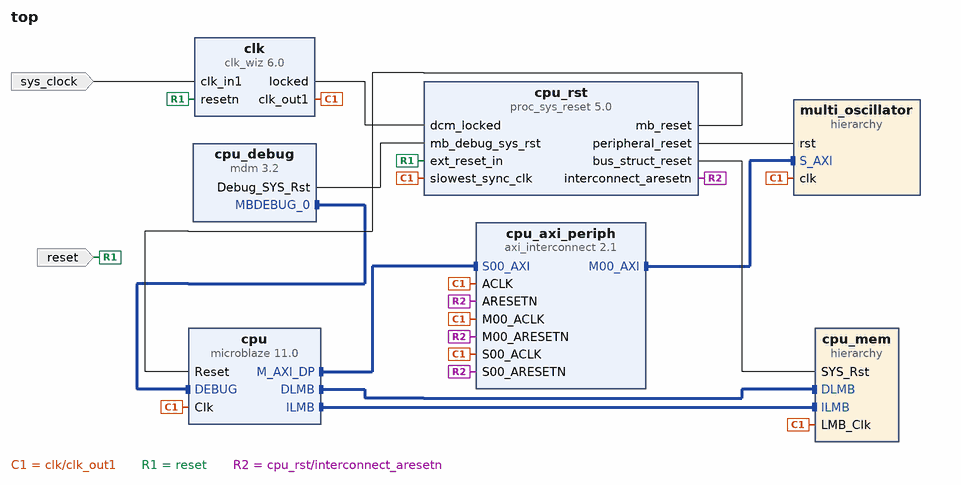
[diagram p0: block diagram of the top level]
# Vivado block design top, xc7a35ticsg324-1L, Vivado 2020.1
create_bd_design top

create_bd_port -dir I -type clk sys_clock
set_property -dict {CONFIG.FREQ_HZ 100000000 CONFIG.PHASE 0.000} [get_bd_ports sys_clock]
create_bd_port -dir I -type rst reset
set_property -dict {CONFIG.POLARITY ACTIVE_LOW} [get_bd_ports reset]

create_bd_cell -type ip -vlnv xilinx.com:ip:clk_wiz:6.0 clk
set_property -dict [list \
  CONFIG.CLK_IN1_BOARD_INTERFACE sys_clock \
  CONFIG.RESET_BOARD_INTERFACE reset \
  CONFIG.RESET_PORT resetn \
  CONFIG.RESET_TYPE ACTIVE_LOW \
  CONFIG.USE_BOARD_FLOW true \
] [get_bd_cells clk]
create_bd_cell -type ip -vlnv xilinx.com:ip:microblaze:11.0 cpu
set_property -dict [list \
  CONFIG.C_ADDR_TAG_BITS 0 \
  CONFIG.C_BRANCH_TARGET_CACHE_SIZE 0 \
  CONFIG.C_DCACHE_ADDR_TAG 0 \
  CONFIG.C_DEBUG_ENABLED 1 \
  CONFIG.C_DIV_ZERO_EXCEPTION 1 \
  CONFIG.C_D_AXI 1 \
  CONFIG.C_D_LMB 1 \
  CONFIG.C_ENABLE_DISCRETE_PORTS 0 \
  CONFIG.C_I_LMB 1 \
  CONFIG.C_M_AXI_D_BUS_EXCEPTION 0 \
  CONFIG.C_NUMBER_OF_PC_BRK 4 \
  CONFIG.C_NUMBER_OF_RD_ADDR_BRK 2 \
  CONFIG.C_NUMBER_OF_WR_ADDR_BRK 2 \
  CONFIG.C_UNALIGNED_EXCEPTIONS 0 \
  CONFIG.C_USE_BARREL 1 \
  CONFIG.C_USE_BRANCH_TARGET_CACHE 1 \
  CONFIG.C_USE_DCACHE 0 \
  CONFIG.C_USE_DIV 1 \
  CONFIG.C_USE_FPU 0 \
  CONFIG.C_USE_HW_MUL 2 \
  CONFIG.C_USE_ICACHE 0 \
  CONFIG.C_USE_MSR_INSTR 0 \
  CONFIG.G_USE_EXCEPTIONS 1 \
] [get_bd_cells cpu]
create_bd_cell -type hier cpu_mem
create_bd_cell -type ip -vlnv xilinx.com:ip:mdm:3.2 cpu_debug
create_bd_cell -type ip -vlnv xilinx.com:ip:proc_sys_reset:5.0 cpu_rst
set_property -dict {CONFIG.RESET_BOARD_INTERFACE reset CONFIG.USE_BOARD_FLOW true} [get_bd_cells cpu_rst]
create_bd_cell -type ip -vlnv xilinx.com:ip:axi_interconnect:2.1 cpu_axi_periph
set_property -dict [list \
  CONFIG.ENABLE_ADVANCED_OPTIONS 0 \
  CONFIG.M00_HAS_REGSLICE 0 \
  CONFIG.NUM_MI 1 \
  CONFIG.NUM_SI 1 \
] [get_bd_cells cpu_axi_periph]
create_bd_cell -type hier multi_oscillator

# ---- hierarchy /cpu_mem ----
current_bd_instance /cpu_mem
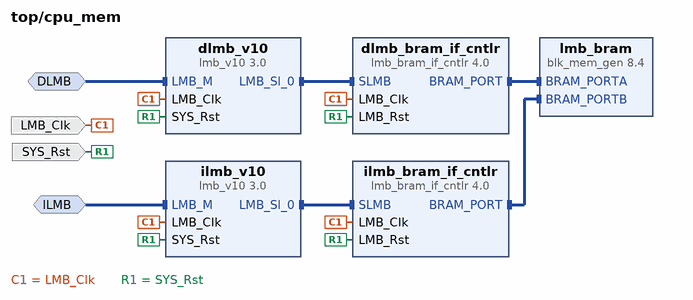
[diagram p1: block diagram inside /cpu_mem]
create_bd_intf_pin -mode MirroredMaster -vlnv xilinx.com:interface:lmb_rtl:1.0 DLMB
create_bd_intf_pin -mode MirroredMaster -vlnv xilinx.com:interface:lmb_rtl:1.0 ILMB
create_bd_pin -dir I -type clk LMB_Clk
create_bd_pin -dir I -type rst SYS_Rst

create_bd_cell -type ip -vlnv xilinx.com:ip:lmb_v10:3.0 dlmb_v10
create_bd_cell -type ip -vlnv xilinx.com:ip:lmb_v10:3.0 ilmb_v10
create_bd_cell -type ip -vlnv xilinx.com:ip:lmb_bram_if_cntlr:4.0 dlmb_bram_if_cntlr
set_property -dict {CONFIG.C_ECC 0} [get_bd_cells dlmb_bram_if_cntlr]
create_bd_cell -type ip -vlnv xilinx.com:ip:lmb_bram_if_cntlr:4.0 ilmb_bram_if_cntlr
set_property -dict {CONFIG.C_ECC 0} [get_bd_cells ilmb_bram_if_cntlr]
create_bd_cell -type ip -vlnv xilinx.com:ip:blk_mem_gen:8.4 lmb_bram
set_property -dict {CONFIG.Memory_Type True_Dual_Port_RAM CONFIG.use_bram_block BRAM_Controller} [get_bd_cells lmb_bram]

# ---- hierarchy /multi_oscillator ----
current_bd_instance /multi_oscillator
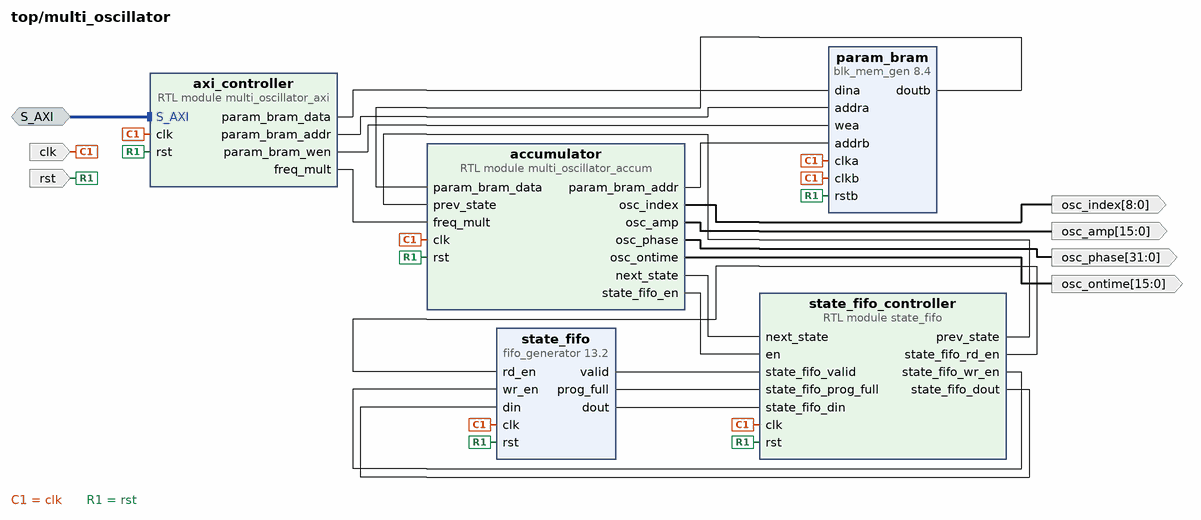
[diagram p2: block diagram inside /multi_oscillator]
create_bd_intf_pin -mode Slave -vlnv xilinx.com:interface:aximm_rtl:1.0 S_AXI
create_bd_pin -dir I -type clk clk
create_bd_pin -dir I -type rst rst
create_bd_pin -dir O -from 8 -to 0 osc_index
create_bd_pin -dir O -from 31 -to 0 osc_phase
create_bd_pin -dir O -from 15 -to 0 osc_amp
create_bd_pin -dir O -from 15 -to 0 osc_ontime

create_bd_cell -type ip -vlnv xilinx.com:ip:blk_mem_gen:8.4 param_bram
set_property -dict [list \
  CONFIG.Assume_Synchronous_Clk true \
  CONFIG.EN_SAFETY_CKT false \
  CONFIG.Enable_32bit_Address false \
  CONFIG.Enable_A Always_Enabled \
  CONFIG.Enable_B Always_Enabled \
  CONFIG.Memory_Type Simple_Dual_Port_RAM \
  CONFIG.Operating_Mode_A WRITE_FIRST \
  CONFIG.Port_B_Clock 100 \
  CONFIG.Port_B_Enable_Rate 100 \
  CONFIG.Read_Width_B 64 \
  CONFIG.Register_PortB_Output_of_Memory_Primitives true \
  CONFIG.Use_Byte_Write_Enable false \
  CONFIG.Use_RSTB_Pin true \
  CONFIG.Write_Depth_A 1024 \
  CONFIG.Write_Width_B 64 \
  CONFIG.use_bram_block Stand_Alone \
] [get_bd_cells param_bram]
create_bd_cell -type module -reference state_fifo state_fifo_controller
create_bd_cell -type ip -vlnv xilinx.com:ip:fifo_generator:13.2 state_fifo
set_property -dict [list \
  CONFIG.Fifo_Implementation Common_Clock_Builtin_FIFO \
  CONFIG.Full_Threshold_Assert_Value 500 \
  CONFIG.Input_Data_Width 64 \
  CONFIG.Input_Depth 512 \
  CONFIG.Programmable_Full_Type Single_Programmable_Full_Threshold_Constant \
  CONFIG.Valid_Flag true \
] [get_bd_cells state_fifo]
create_bd_cell -type module -reference multi_oscillator_accum accumulator
create_bd_cell -type module -reference multi_oscillator_axi axi_controller

# ---- connections ----

current_bd_instance /cpu_mem
connect_bd_intf_net -intf_net microblaze_0_dlmb_bus [get_bd_intf_pins dlmb_v10/LMB_Sl_0] [get_bd_intf_pins dlmb_bram_if_cntlr/SLMB]
connect_bd_intf_net -intf_net microblaze_0_ilmb [get_bd_intf_pins ILMB] [get_bd_intf_pins ilmb_v10/LMB_M]
connect_bd_intf_net -intf_net microblaze_0_ilmb_bus [get_bd_intf_pins ilmb_v10/LMB_Sl_0] [get_bd_intf_pins ilmb_bram_if_cntlr/SLMB]
connect_bd_intf_net -intf_net microblaze_0_dlmb_cntlr [get_bd_intf_pins dlmb_bram_if_cntlr/BRAM_PORT] [get_bd_intf_pins lmb_bram/BRAM_PORTA]
connect_bd_intf_net -intf_net microblaze_0_ilmb_cntlr [get_bd_intf_pins ilmb_bram_if_cntlr/BRAM_PORT] [get_bd_intf_pins lmb_bram/BRAM_PORTB]
connect_bd_intf_net -intf_net microblaze_0_dlmb [get_bd_intf_pins DLMB] [get_bd_intf_pins dlmb_v10/LMB_M]
connect_bd_net -net microblaze_0_Clk [get_bd_pins LMB_Clk] \
  [get_bd_pins dlmb_v10/LMB_Clk] [get_bd_pins dlmb_bram_if_cntlr/LMB_Clk] [get_bd_pins ilmb_v10/LMB_Clk] \
  [get_bd_pins ilmb_bram_if_cntlr/LMB_Clk]
connect_bd_net [get_bd_pins SYS_Rst] \
  [get_bd_pins dlmb_v10/SYS_Rst] [get_bd_pins dlmb_bram_if_cntlr/LMB_Rst] [get_bd_pins ilmb_v10/SYS_Rst] \
  [get_bd_pins ilmb_bram_if_cntlr/LMB_Rst]
set_property HDL_ATTRIBUTE.BMM_INFO_ADDRESS_SPACE {byte  0x00000000 32 > top cpu_mem/lmb_bram} [get_bd_cells dlmb_bram_if_cntlr]
set_property HDL_ATTRIBUTE.KEEP_HIERARCHY yes [get_bd_cells dlmb_bram_if_cntlr]

current_bd_instance /multi_oscillator
connect_bd_intf_net [get_bd_intf_pins S_AXI] [get_bd_intf_pins axi_controller/S_AXI]
connect_bd_net [get_bd_pins clk] \
  [get_bd_pins param_bram/clka] [get_bd_pins param_bram/clkb] [get_bd_pins state_fifo_controller/clk] \
  [get_bd_pins state_fifo/clk] [get_bd_pins accumulator/clk] [get_bd_pins axi_controller/clk]
connect_bd_net [get_bd_pins rst] \
  [get_bd_pins param_bram/rstb] [get_bd_pins state_fifo_controller/rst] [get_bd_pins state_fifo/rst] \
  [get_bd_pins accumulator/rst] [get_bd_pins axi_controller/rst]
connect_bd_net [get_bd_pins axi_controller/freq_mult] [get_bd_pins accumulator/freq_mult]
connect_bd_net [get_bd_pins axi_controller/param_bram_data] [get_bd_pins param_bram/dina]
connect_bd_net [get_bd_pins axi_controller/param_bram_addr] [get_bd_pins param_bram/addra]
connect_bd_net -net axi_controller_freq_bram_wen [get_bd_pins axi_controller/param_bram_wen] [get_bd_pins param_bram/wea]
connect_bd_net -net multi_oscillator_acc_0_param_bram_addr [get_bd_pins accumulator/param_bram_addr] [get_bd_pins param_bram/addrb]
connect_bd_net -net blk_mem_gen_0_doutb [get_bd_pins param_bram/doutb] [get_bd_pins accumulator/param_bram_data]
connect_bd_net -net multi_oscillator_acc_0_next_state [get_bd_pins accumulator/next_state] [get_bd_pins state_fifo_controller/next_state]
connect_bd_net -net state_fifo_0_prev_state [get_bd_pins state_fifo_controller/prev_state] [get_bd_pins accumulator/prev_state]
connect_bd_net -net multi_oscillator_acc_0_state_fifo_en [get_bd_pins accumulator/state_fifo_en] [get_bd_pins state_fifo_controller/en]
connect_bd_net -net fifo_generator_0_valid [get_bd_pins state_fifo/valid] [get_bd_pins state_fifo_controller/state_fifo_valid]
connect_bd_net -net fifo_generator_0_prog_full [get_bd_pins state_fifo/prog_full] [get_bd_pins state_fifo_controller/state_fifo_prog_full]
connect_bd_net -net state_fifo_0_state_fifo_rd_en [get_bd_pins state_fifo_controller/state_fifo_rd_en] [get_bd_pins state_fifo/rd_en]
connect_bd_net -net state_fifo_0_state_fifo_wr_en [get_bd_pins state_fifo_controller/state_fifo_wr_en] [get_bd_pins state_fifo/wr_en]
connect_bd_net -net state_fifo_0_state_fifo_dout [get_bd_pins state_fifo_controller/state_fifo_dout] [get_bd_pins state_fifo/din]
connect_bd_net -net fifo_generator_0_dout [get_bd_pins state_fifo/dout] [get_bd_pins state_fifo_controller/state_fifo_din]
connect_bd_net -net multi_oscillator_acc_0_osc_index [get_bd_pins accumulator/osc_index] [get_bd_pins osc_index]
connect_bd_net -net multi_oscillator_acc_0_osc_phase [get_bd_pins accumulator/osc_phase] [get_bd_pins osc_phase]
connect_bd_net -net multi_oscillator_acc_0_osc_amp [get_bd_pins accumulator/osc_amp] [get_bd_pins osc_amp]
connect_bd_net -net multi_oscillator_acc_0_osc_ontime [get_bd_pins accumulator/osc_ontime] [get_bd_pins osc_ontime]

current_bd_instance /
connect_bd_intf_net -intf_net microblaze_0_debug [get_bd_intf_pins cpu_debug/MBDEBUG_0] [get_bd_intf_pins cpu/DEBUG]
connect_bd_intf_net [get_bd_intf_pins cpu/M_AXI_DP] [get_bd_intf_pins cpu_axi_periph/S00_AXI]
connect_bd_intf_net -intf_net microblaze_0_dlmb_1 [get_bd_intf_pins cpu/DLMB] [get_bd_intf_pins cpu_mem/DLMB]
connect_bd_intf_net [get_bd_intf_pins cpu_axi_periph/M00_AXI] [get_bd_intf_pins multi_oscillator/S_AXI]
connect_bd_intf_net -intf_net microblaze_0_ilmb_1 [get_bd_intf_pins cpu/ILMB] [get_bd_intf_pins cpu_mem/ILMB]
connect_bd_net [get_bd_ports sys_clock] [get_bd_pins clk/clk_in1]
connect_bd_net -net microblaze_0_Clk [get_bd_pins clk/clk_out1] \
  [get_bd_pins cpu/Clk] [get_bd_pins cpu_mem/LMB_Clk] [get_bd_pins cpu_rst/slowest_sync_clk] \
  [get_bd_pins cpu_axi_periph/ACLK] [get_bd_pins cpu_axi_periph/S00_ACLK] [get_bd_pins cpu_axi_periph/M00_ACLK] \
  [get_bd_pins multi_oscillator/clk]
connect_bd_net [get_bd_pins clk/locked] [get_bd_pins cpu_rst/dcm_locked]
connect_bd_net -net rst_clk_100M_mb_reset [get_bd_pins cpu_rst/mb_reset] [get_bd_pins cpu/Reset]
connect_bd_net -net rst_clk_100M_bus_struct_reset [get_bd_pins cpu_rst/bus_struct_reset] [get_bd_pins cpu_mem/SYS_Rst]
connect_bd_net -net mdm_1_debug_sys_rst [get_bd_pins cpu_debug/Debug_SYS_Rst] [get_bd_pins cpu_rst/mb_debug_sys_rst]
connect_bd_net -net reset_0_1 [get_bd_ports reset] [get_bd_pins clk/resetn] [get_bd_pins cpu_rst/ext_reset_in]
connect_bd_net [get_bd_pins cpu_rst/interconnect_aresetn] \
  [get_bd_pins cpu_axi_periph/ARESETN] [get_bd_pins cpu_axi_periph/S00_ARESETN] [get_bd_pins cpu_axi_periph/M00_ARESETN]
connect_bd_net [get_bd_pins cpu_rst/peripheral_reset] [get_bd_pins multi_oscillator/rst]
set_property HDL_ATTRIBUTE.BMM_INFO_PROCESSOR {microblaze-le > top cpu_mem/dlmb_bram_if_cntlr} [get_bd_cells cpu]
set_property HDL_ATTRIBUTE.KEEP_HIERARCHY yes [get_bd_cells cpu]

# ---- address map ----
assign_bd_address -offset 0x00000000 -range 32K -target_address_space [get_bd_addr_spaces cpu/Data] [get_bd_addr_segs cpu_mem/dlmb_bram_if_cntlr/SLMB/Mem]
assign_bd_address -offset 0x10000000 -range 256M -target_address_space [get_bd_addr_spaces cpu/Data] [get_bd_addr_segs multi_oscillator/axi_controller/S_AXI/reg0]
assign_bd_address -offset 0x00000000 -range 32K -target_address_space [get_bd_addr_spaces cpu/Instruction] [get_bd_addr_segs cpu_mem/ilmb_bram_if_cntlr/SLMB/Mem]

validate_bd_design
save_bd_design
